# Altium project Dashboard.PrjPcb
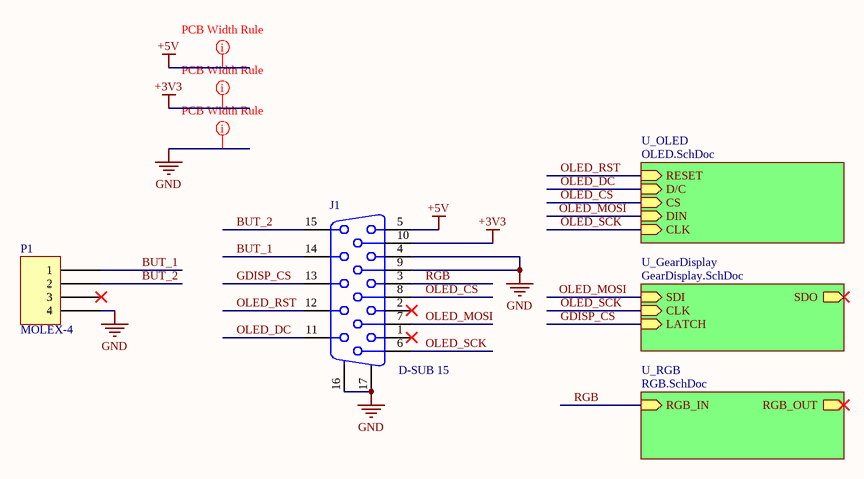
[diagram p0: Main.SchDoc]
4 sheets, 17 parts. Net scope: hierarchical (ports join the sheet entries above them; power ports are global).
Board files: PCB1.PcbDoc, PCB2_homemade.PcbDoc, PCB3_factory.PcbDoc
Sheets:
  Main.SchDoc
    U_RGB = RGB.SchDoc
    U_OLED = OLED.SchDoc
    U_GearDisplay = GearDisplay.SchDoc

## Sheet Main.SchDoc
size A4; Author: Wojciech Gredel; CompanyName: AGH UST; Revision: 1; ProjectName: My_project1

### Parts
J1  D-SUB 15  [Dsub-3H15]
P1  MOLEX-4  [MOLEX_4_PIN]

### Sub-sheets
U_GearDisplay = GearDisplay.SchDoc: SDI (in), CLK (in), LATCH (in), SDO (out)
U_OLED = OLED.SchDoc: RESET (in), D/C (in), CS (in), DIN (in), CLK (in)
U_RGB = RGB.SchDoc: RGB_OUT (out), RGB_IN (in)

### Nets
+3V3: J1.10
+5V: J1.5
GND: J1.4 J1.9 J1.16(MH1) J1.17(MH2) P1.4
BUT_1: J1.14 P1.1
BUT_2: J1.15 P1.2
GDISP_CS: J1.13 ; sheet U_GearDisplay/LATCH
OLED_CS: J1.8 ; sheet U_OLED/CS
OLED_DC: J1.11 ; sheet U_OLED/D/C
OLED_MOSI: J1.7 ; sheet U_OLED/DIN, sheet U_GearDisplay/SDI
OLED_RST: J1.12 ; sheet U_OLED/RESET
OLED_SCK: J1.6 ; sheet U_OLED/CLK, sheet U_GearDisplay/CLK
RGB: J1.3 ; sheet U_RGB/RGB_IN

Not connected (* = marked no-connect by the designer): J1 1* 2*; P1 3*

### Layout directives
rule Width Constraint [Pref Width = 25mil    Min Width = 20mil    Max Width = 30mil]: +3V3, +5V
rule Width Constraint [Pref Width = 25mil    Min Width = 10mil    Max Width = 30mil]: GND

### Notes on the sheet
- Confidential / Not for distribution !
- Project name:
- Document name:
- Designer Name:
- Date/Time:
- Revision:

### Library data of the parts
J1 = D-SUB 15: Receptacle Assembly, 15-Pin, Sim Line Connector; Manufacturer: TE Connectivity; PackageDocument: B; Positions: 15; Gender: Receptacle Header; Published: 15-Jun-2001; LatestRevisionDate: 17-Jul-2002; LatestRevisionNote: Re-released for DXP Platform.; DatasheetDocument: 24-Nov-1999; PackageReference: 788574; Publisher: Altium Limited; Orientation: Right Angle; Supplier: TME; Supplier Part Number: 1-1734530-3
P1 = MOLEX-4: 4 pin socket; Manufacturer: Molex; Supplier: TME; Supplier Part Number: MX-43045-0400

## Sheet RGB.SchDoc
size A4; Author: Wojciech Gredel; CompanyName: AGH UST; Revision: 1; ProjectName: My_project1
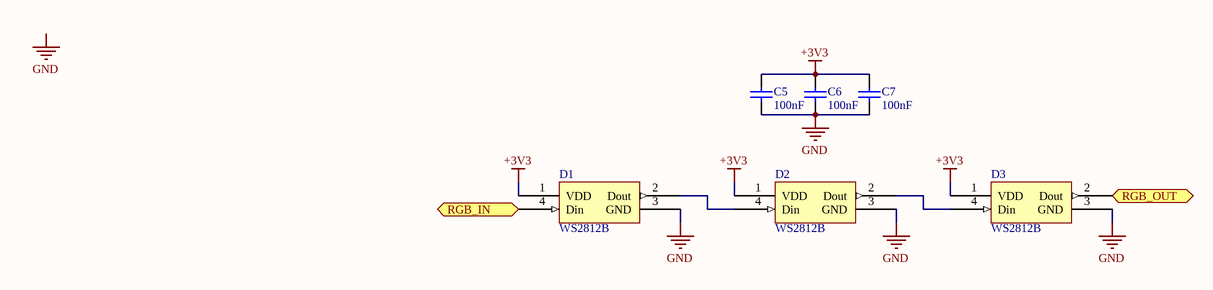
[diagram p1: RGB.SchDoc]

### Parts
C5  value 100nF  [CAP_0805_IPC_MD]  (hidden comment: Cap)
C6  value 100nF  [CAP_0805_IPC_MD]  (hidden comment: Cap)
C7  value 100nF  [CAP_0805_IPC_MD]  (hidden comment: Cap)
D1  RGB LED  [WS2812B]  (value not drawn)
D2  RGB LED  [WS2812B]  (value not drawn)
D3  RGB LED  [WS2812B]  (value not drawn)

### Ports
RGB_IN (in), RGB_OUT (out)

### Nets
+3V3: C5.2 C6.2 C7.2 D1.1(VDD) D2.1(VDD) D3.1(VDD)
GND: C5.1 C6.1 C7.1 D1.3(GND) D2.3(GND) D3.3(GND)
RGB: D1.4(Din) ; port RGB_IN
NetD1_2: D1.2(Dout) D2.4(Din)
NetD2_2: D2.2(Dout) D3.4(Din)
NetD3_2: D3.2(Dout) ; port RGB_OUT

### Notes on the sheet
- Labels drawn without touching a wire or pin: GND
- Confidential / Not for distribution !
- Project name:
- Document name:
- Designer Name:
- Date/Time:
- Revision:

### Library data of the parts
C5-C7 = Cap: Capacitor; Manufacturer: Samsung; Supplier Part Number: CL21B104KBCNNNC; Supplier: TME
D1-D3 = RGB LED: Programmable RGB LED; Manufacturer: Worldsemi; Supplier: TME; Supplier Part Number: WS2812B; Manufacturer Part Number: WS2812B

## Sheet OLED.SchDoc
size A4; Author: Wojciech Gredel; CompanyName: AGH UST; Revision: 1; ProjectName: My_project1
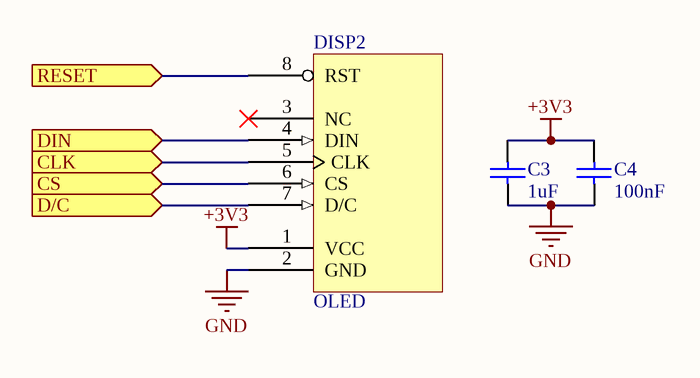
[diagram p2: OLED.SchDoc]

### Parts
C3  value 1uF  [CAP_0805_IPC_MD]  (hidden comment: Cap)
C4  value 100nF  [CAP_0805_IPC_MD]  (hidden comment: Cap)
DISP2  OLED  [OLED_1.3_INCH]

### Ports
CLK (in), CS (in), D/C (in), DIN (in), RESET (in)

### Nets
+3V3: C3.2 C4.2 DISP2.1(VCC)
GND: C3.1 C4.1 DISP2.2(GND)
OLED_CS: DISP2.6(CS) ; port CS
OLED_DC: DISP2.7(D/C) ; port D/C
OLED_MOSI: DISP2.4(DIN) ; port DIN
OLED_RST: DISP2.8(RST) ; port RESET
OLED_SCK: DISP2.5(CLK) ; port CLK

Not connected (* = marked no-connect by the designer): DISP2 3(NC)*

### Notes on the sheet
- Confidential / Not for distribution !
- Project name:
- Document name:
- Designer Name:
- Date/Time:
- Revision:

### Library data of the parts
C3 C4 = Cap: Capacitor; Manufacturer: Samsung; Supplier: TME
  C3: Supplier Part Number: CL21B105KOFNNNF
  C4: Supplier Part Number: CL21B104KBCNNNC
DISP2 = OLED: Manufacturer: *; Manufacturer Part Number: *

## Sheet GearDisplay.SchDoc
size A4; Author: Wojciech Gredel; CompanyName: AGH UST; Revision: 1; ProjectName: My_project1
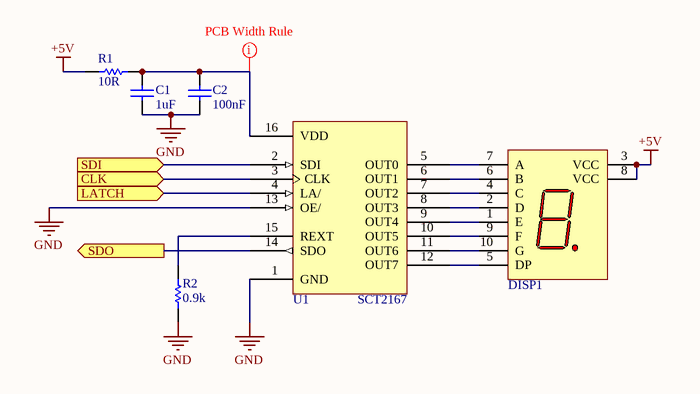
[diagram p3: GearDisplay.SchDoc]

### Parts
C1  value 1uF  [CAP_0805_IPC_MD]  (hidden comment: Cap)
C2  value 100nF  [CAP_0805_IPC_MD]  (hidden comment: Cap)
DISP1  7SEG DISP  [7_SEG_LED_0.8_INCH]  (value not drawn)
R1  value 10R  [RES_0805_IPC_MD]  (hidden comment: Res)
R2  value 0.9k  [RES_0805_IPC_MD]  (hidden comment: Res)
U1  SCT2167  [SSOP_16_IPC_MD]

### Ports
CLK (in), LATCH (in), SDI (in), SDO (out)

### Nets
+5V: DISP1.3(VCC) DISP1.8(VCC) R1.1
GND: C1.1 C2.1 R2.2 U1.1(GND) U1.13(OE/)
GDISP_CS: U1.4(LA/) ; port LATCH
OLED_MOSI: U1.2(SDI) ; port SDI
OLED_SCK: U1.3(CLK) ; port CLK
NetC1_2: C1.2 C2.2 R1.2 U1.16(VDD)
NetDISP1_1: DISP1.1(E) U1.9(OUT4)
NetDISP1_2: DISP1.2(D) U1.8(OUT3)
NetDISP1_4: DISP1.4(C) U1.7(OUT2)
NetDISP1_5: DISP1.5(DP) U1.12(OUT7)
NetDISP1_6: DISP1.6(B) U1.6(OUT1)
NetDISP1_7: DISP1.7(A) U1.5(OUT0)
NetDISP1_9: DISP1.9(F) U1.10(OUT5)
NetDISP1_10: DISP1.10(G) U1.11(OUT6)
NetR2_1: R2.1 U1.15(REXT)
NetU1_14: U1.14(SDO) ; port SDO

### Layout directives
rule Width Constraint [Pref Width = 25mil    Min Width = 20mil    Max Width = 30mil]: NetC1_2

### Notes on the sheet
- Confidential / Not for distribution !
- Project name:
- Document name:
- Designer Name:
- Date/Time:
- Revision:

### Library data of the parts
C1 C2 = Cap: Capacitor; Manufacturer: Samsung; Supplier: TME
  C1: Supplier Part Number: CL21B105KOFNNNF
  C2: Supplier Part Number: CL21B104KBCNNNC
DISP1 = 7SEG DISP: OPTO PLUS LED CORP. OPD-S8023LB-BW; Supplier: TME; Supplier Part Number: OPD-S8023LB-BW; Manufacturer: Opto Plus Led Corp.
R1 R2 = Res: Resistor; Manufacturer: Royal Ohm; Supplier: TME
  R1: Supplier Part Number: HP05-10R5%
  R2: Supplier Part Number: SMD0805-910R-1%
U1 = SCT2167: Led controller; Manufacturer: Starchips Technology; Supplier: TME; Supplier Part Number: SCT2167CSSG

## Nets that join several sheets
+3V3: Main (J1.10), RGB (6 pins), OLED (C3.2 C4.2 DISP2.1)
+5V: Main (J1.5), GearDisplay (DISP1.3 DISP1.8 R1.1)
GND: Main (5 pins), RGB (6 pins), OLED (C3.1 C4.1 DISP2.2), GearDisplay (5 pins)
GDISP_CS: Main (J1.13), GearDisplay (U1.4)
OLED_CS: Main (J1.8), OLED (DISP2.6)
OLED_DC: Main (J1.11), OLED (DISP2.7)
OLED_MOSI: Main (J1.7), OLED (DISP2.4), GearDisplay (U1.2)
OLED_RST: Main (J1.12), OLED (DISP2.8)
OLED_SCK: Main (J1.6), OLED (DISP2.5), GearDisplay (U1.3)
RGB: Main (J1.3), RGB (D1.4)